# EAGLE schematic basicController (EAGLE 8.1.0)
DOC_NUM: 1; REVISION: 6
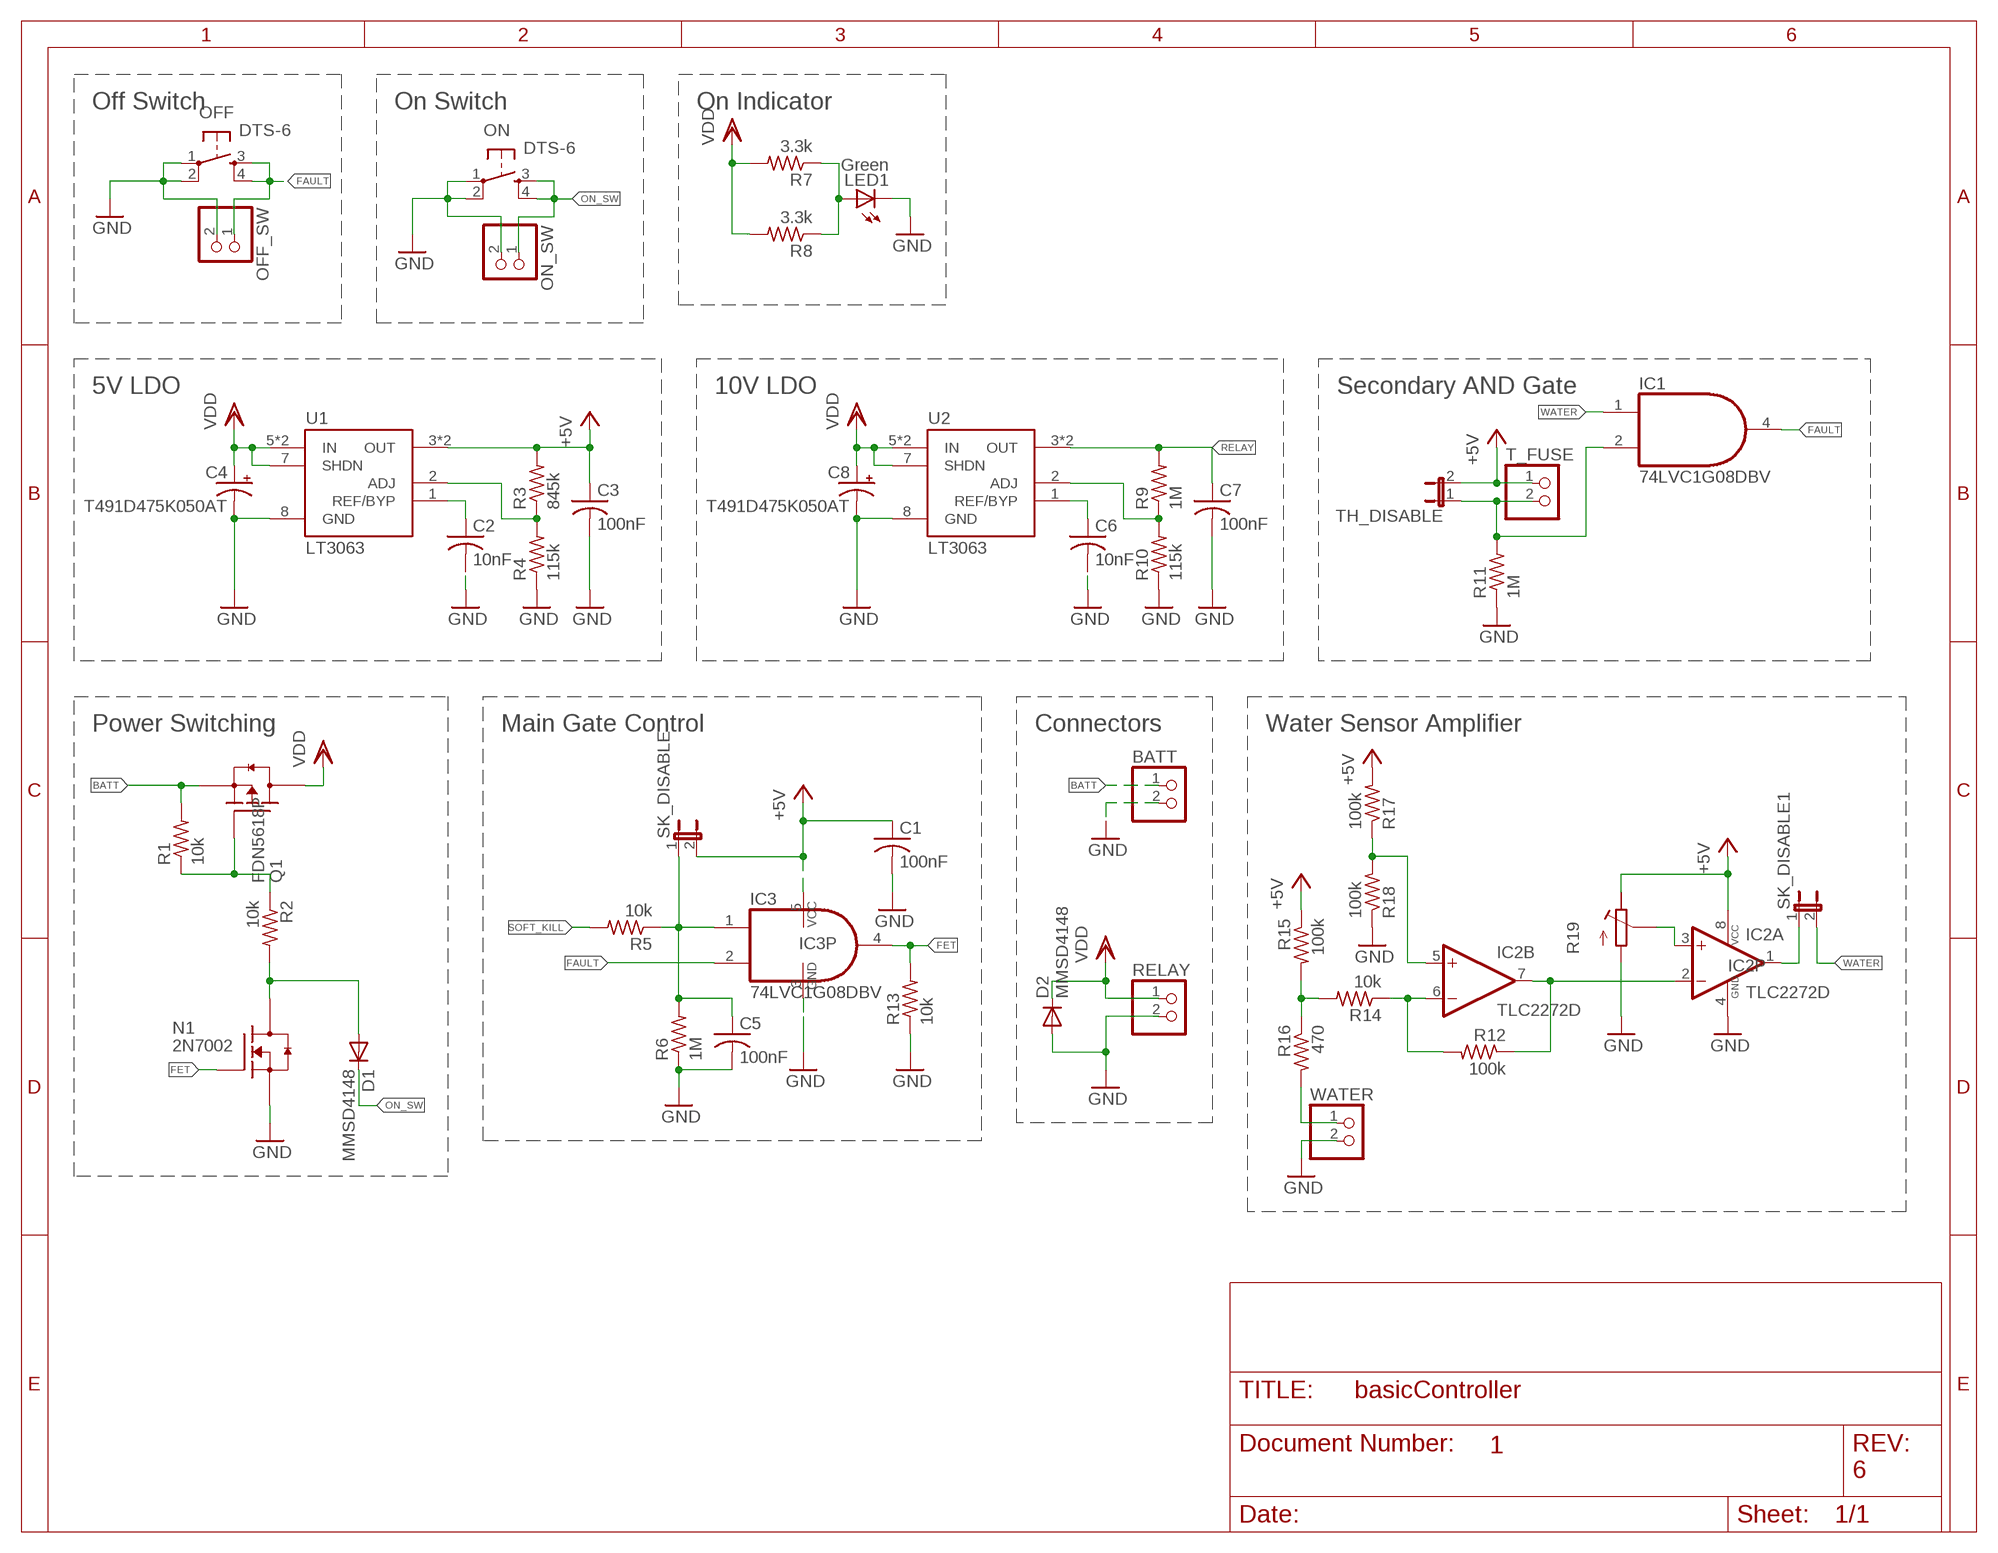
[diagram p0: schematic, sheet 1]

## Parts
BATT  PINHD-1X2  [1X02]
C1  100nF  C-USC0805  [C0805]
C2  10nF  C-USC0805  [C0805]
C3  100nF  C-USC0805  [C0805]
C4  T491D475K050AT  CPOL-USCT7343  [CT7343]
C5  100nF  C-USC0805  [C0805]
C6  10nF  C-USC0805  [C0805]
C7  100nF  C-USC0805  [C0805]
C8  T491D475K050AT  CPOL-USCT7343  [CT7343]
D1  MMSD4148  DIODE-SOD123  [SOD123]
D2  MMSD4148  DIODE-SOD123  [SOD123]
IC1  74LVC1G08DBV  [SOT23-5]
IC2  TLC2272D  [SO-08]
IC3  74LVC1G08DBV  [SOT23-5]
LED1  Green  LEDCHIP-LED0805  [CHIP-LED0805]
N1  2N7002  [SOT23]
OFF  DTS-6  [DTS-6]
OFF_SW  PINHD-1X2  [1X02]
ON  DTS-6  [DTS-6]
ON_SW  PINHD-1X2  [1X02]
Q1  FDN5618P  [SOT23]
R1  10k  R-US_R0805  [R0805]
R2  10k  R-US_R0805  [R0805]
R3  845k  R-US_R0805  [R0805]
R4  115k  R-US_R0805  [R0805]
R5  10k  R-US_R0805  [R0805]
R6  1M  R-US_R0805  [R0805]
R7  3.3k  R-US_R0805  [R0805]
R8  3.3k  R-US_R0805  [R0805]
R9  1M  R-US_R0805  [R0805]
R10  115k  R-US_R0805  [R0805]
R11  1M  R-US_R0805  [R0805]
R12  100k  R-US_R0805  [R0805]
R13  10k  R-US_R0805  [R0805]
R14  10k  R-US_R0805  [R0805]
R15  100k  R-US_R0805  [R0805]
R16  470  R-US_R0805  [R0805]
R17  100k  R-US_R0805  [R0805]
R18  100k  R-US_R0805  [R0805]
R19  R-TRIMM3314J  [RTRIM3314J]
RELAY  PINHD-1X2  [1X02]
SK_DISABLE  JP1E  [JP1]
SK_DISABLE1  JP1E  [JP1]
T_FUSE  PINHD-1X2  [1X02]
TH_DISABLE  JP1E  [JP1]
U1  LT3063  [MSOP8]
U2  LT3063  [MSOP8]
WATER  PINHD-1X2  [1X02]

## Nets
+5V: C1.1 C3.1 IC2.8(P:VCC) IC3.5(VCC) R3.2 R15.1 R17.2 R19.3(A) SK_DISABLE.2 T_FUSE.1 TH_DISABLE.2 U1.3(OUT) U1.4(OUT)
BATT: BATT.1 Q1.2(S) R1.2
FAULT: IC1.4(O) IC3.2(I1) OFF.3 OFF.4 OFF_SW.1
FET: IC3.4(O) N1.1(G) R13.2
GND: BATT.2 C1.2 C2.2 C3.2 C4.- C5.2 C6.2 C7.2 C8.- D2.A IC2.4(P:GND) IC3.3(GND) LED1.C N1.2(S) OFF.1 OFF.2 OFF_SW.2 ON.1 ON.2 ON_SW.2 R4.1 R6.1 R10.1 R11.1 R13.1 R18.1 R19.1(E) RELAY.2 U1.8(GND) U2.8(GND) WATER.2
N$1: R9.1 R10.2 U2.2(ADJ)
N$2: R3.1 R4.2 U1.2(ADJ)
N$3: Q1.1(G) R1.1 R2.1
N$4: D1.A N1.3(D) R2.2
N$5: LED1.A R7.1 R8.1
N$6: C2.1 U1.1(REF/BYP)
N$7: C6.1 U2.1(REF/BYP)
N$8: IC1.2(I1) R11.2 T_FUSE.2 TH_DISABLE.1
N$9: IC2.2(A:-IN) IC2.7(B:OUT) R12.1
N$10: IC2.6(B:-IN) R12.2 R14.1
N$11: IC2.5(B:+IN) R17.1 R18.2
N$12: R16.2 WATER.1
N$13: R14.2 R15.2 R16.1
N$14: IC2.1(A:OUT) SK_DISABLE1.1
N$15: IC2.3(A:+IN) R19.2(S)
ON_SW: D1.C ON.3 ON.4 ON_SW.1
RELAY: C7.1 R9.2 U2.3(OUT) U2.4(OUT)
SK: C5.1 IC3.1(I0) R5.1 R6.2 SK_DISABLE.1
SOFT_KILL: R5.2
VDD: C4.+ C8.+ D2.C Q1.3(D) R7.2 R8.2 RELAY.1 U1.5(IN) U1.6(IN) U1.7(SHDN) U2.5(IN) U2.6(IN) U2.7(SHDN)
WATER: IC1.1(I0) SK_DISABLE1.2

## Notes on the sheet
- Off Switch | On Switch | On Indicator
- 5V LDO | 10V LDO | Secondary AND Gate
- Power Switching | Main Gate Control | Connectors | Water Sensor Amplifier

## Power pins joined to a net without a drawn wire
GND: IC1.3(GND)
VCC: IC1.5(VCC)

## Library data of the parts
BATT OFF_SW ON_SW RELAY T_FUSE WATER = pinhead:PINHD-1X2: PIN HEADER
C1-C3 C5-C7 = resistor:C-US: CAPACITOR, American symbol
C4 C8 = resistor:CPOL-US: POLARIZED CAPACITOR, American symbol
D1 D2 = diode:DIODE-: DIODE
IC1 IC3 = 74xx-little-us:74*1G08: 2-input AND gate
IC2 = texas:TLC2272
LED1 = led:LED: LED OSRAM: - CHIPLED LG R971, LG N971, LY N971, LG Q971, LY Q971, LO R971, LY R971 LH N974, LH R974 LS Q976, LO Q976, LY Q976 LO Q996 - Hyper CHIPLED LW Q18S LB Q993, LB Q99A, LB R99A - SideLED LS A670, LO A670, LY A670, LG A670, LP A670 LB A673, LV A673, LT A673, LW A673 LH A674 LY A675 LS A676, LA A676, LO A676, LY A676, LW A676 LS A679, LY A679, LG A679 - Hyper Micro SIDELED® LS Y876, LA Y876, LO Y876, LY Y876 LT Y87S - SmartLED LW L88C, LW L88S LB L89C, LB L89S, LG L890 LS L89K, LO L89K, LY L89K LS L896, LA L896, LO L896, LY L896 - TOPLED LS T670, LO T670, LY T670, LG T670, LP T670 LSG T670, LSP T670, LSY T670, LOP T670, LYG T670 LG T671, LOG T671, LSG T671 LB T673, LV T673, LT T673, LW T673 LH T674 LS T676, LA T676, LO T676, LY T676, LB T676, LH T676, LSB T676, LW T676 LB T67C, LV T67C, LT T67C, LS T67K, LO T67K, LY T67K, LW E67C LS E67B, LA E67B, LO E67B, LY E67B, LB E67C, LV E67C, LT E67C LW T67C LS T679, LY T679, LG T679 LS T770, LO T770, LY T770, LG T770, LP T770 LB T773, LV T773, LT T773, LW T773 LH T774 LS E675, LA E675, LY E675, LS T675 LS T776, LA T776, LO T776, LY T776, LB T776 LHGB T686 LT T68C, LB T68C - Hyper Mini TOPLED® LB M676 - Mini TOPLED Santana® LG M470 LS M47K, LO M47K, LY M47K Source: http://www.osram.convergy.de LUXEON: - LUMILED® LXK2-PW12-R00, LXK2-PW12-S00, LXK2-PW14-U00, LXK2-PW14-V00 LXK2-PM12-R00, LXK2-PM12-S00, LXK2-PM14-U00 LXK2-PE12-Q00, LXK2-PE12-R00, LXK2-PE12-S00, LXK2-PE14-T00, LXK2-PE14-U00 LXK2-PB12-K00, LXK2-PB12-L00, LXK2-PB12-M00, LXK2-PB14-N00, LXK2-PB14-P00, LXK2-PB14-Q00 LXK2-PR12-L00, LXK2-PR12-M00, LXK2-PR14-Q00, LXK2-PR14-R00 LXK2-PD12-Q00, LXK2-PD12-R00, LXK2-PD12-S00 LXK2-PH12-R00, LXK2-PH12-S00 LXK2-PL12-P00, LXK2-PL12-Q00, LXK2-PL12-R00 Source: www.luxeon.com KINGBRIGHT: KA-3528ASYC Source: www.kingbright.com
N1 = transistor-fet:2N7002
OFF ON = switch-tact:DTS-6
Q1 = transistor-fet:FDN5618P
R1-R18 = resistor:R-US_: RESISTOR, American symbol
R19 = resistor:R-TRIMM: Trimm resistor
SK_DISABLE SK_DISABLE1 TH_DISABLE = jumper:JP1E: JUMPER
U1 U2 = linear:LT3063